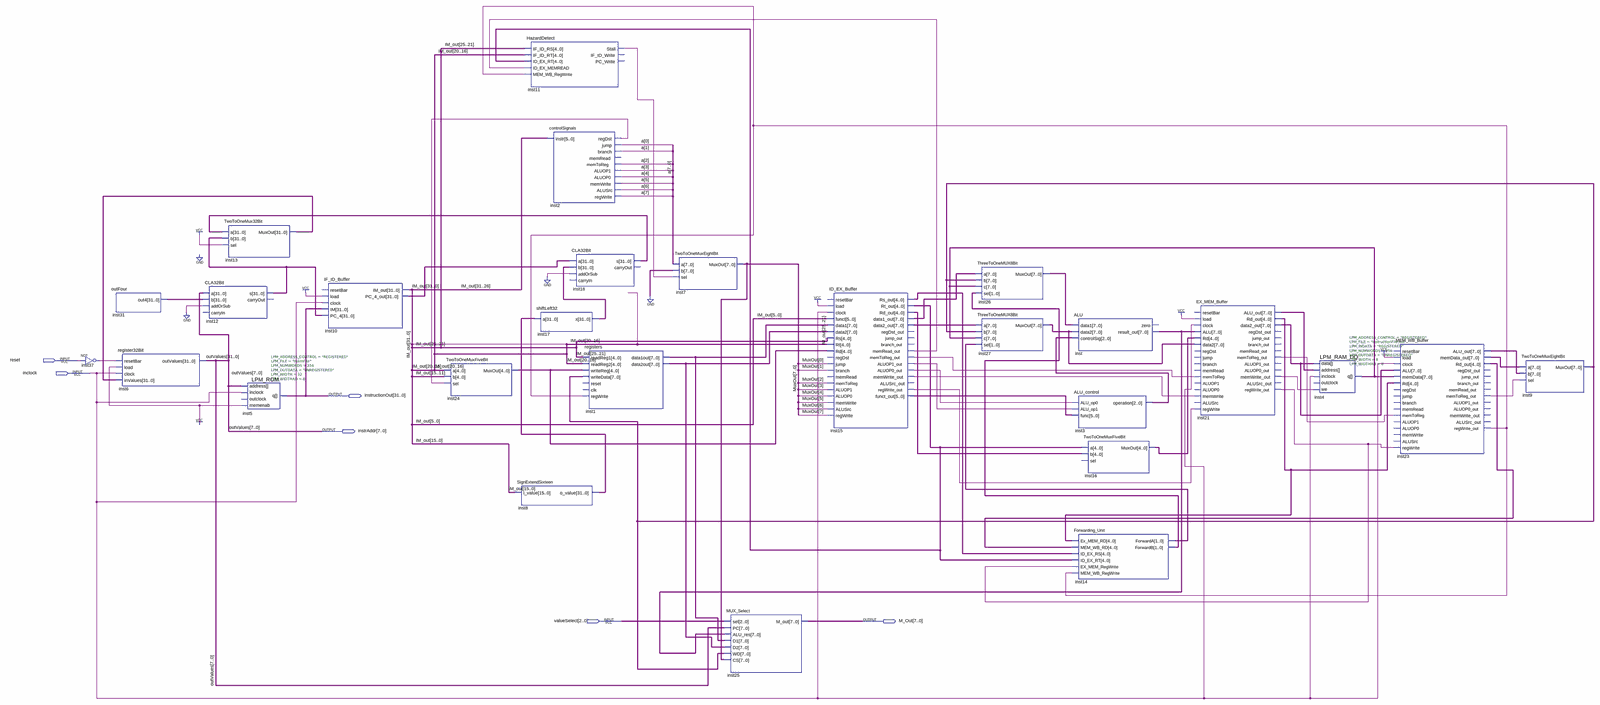
[diagram p0: schematic sheet, whole]
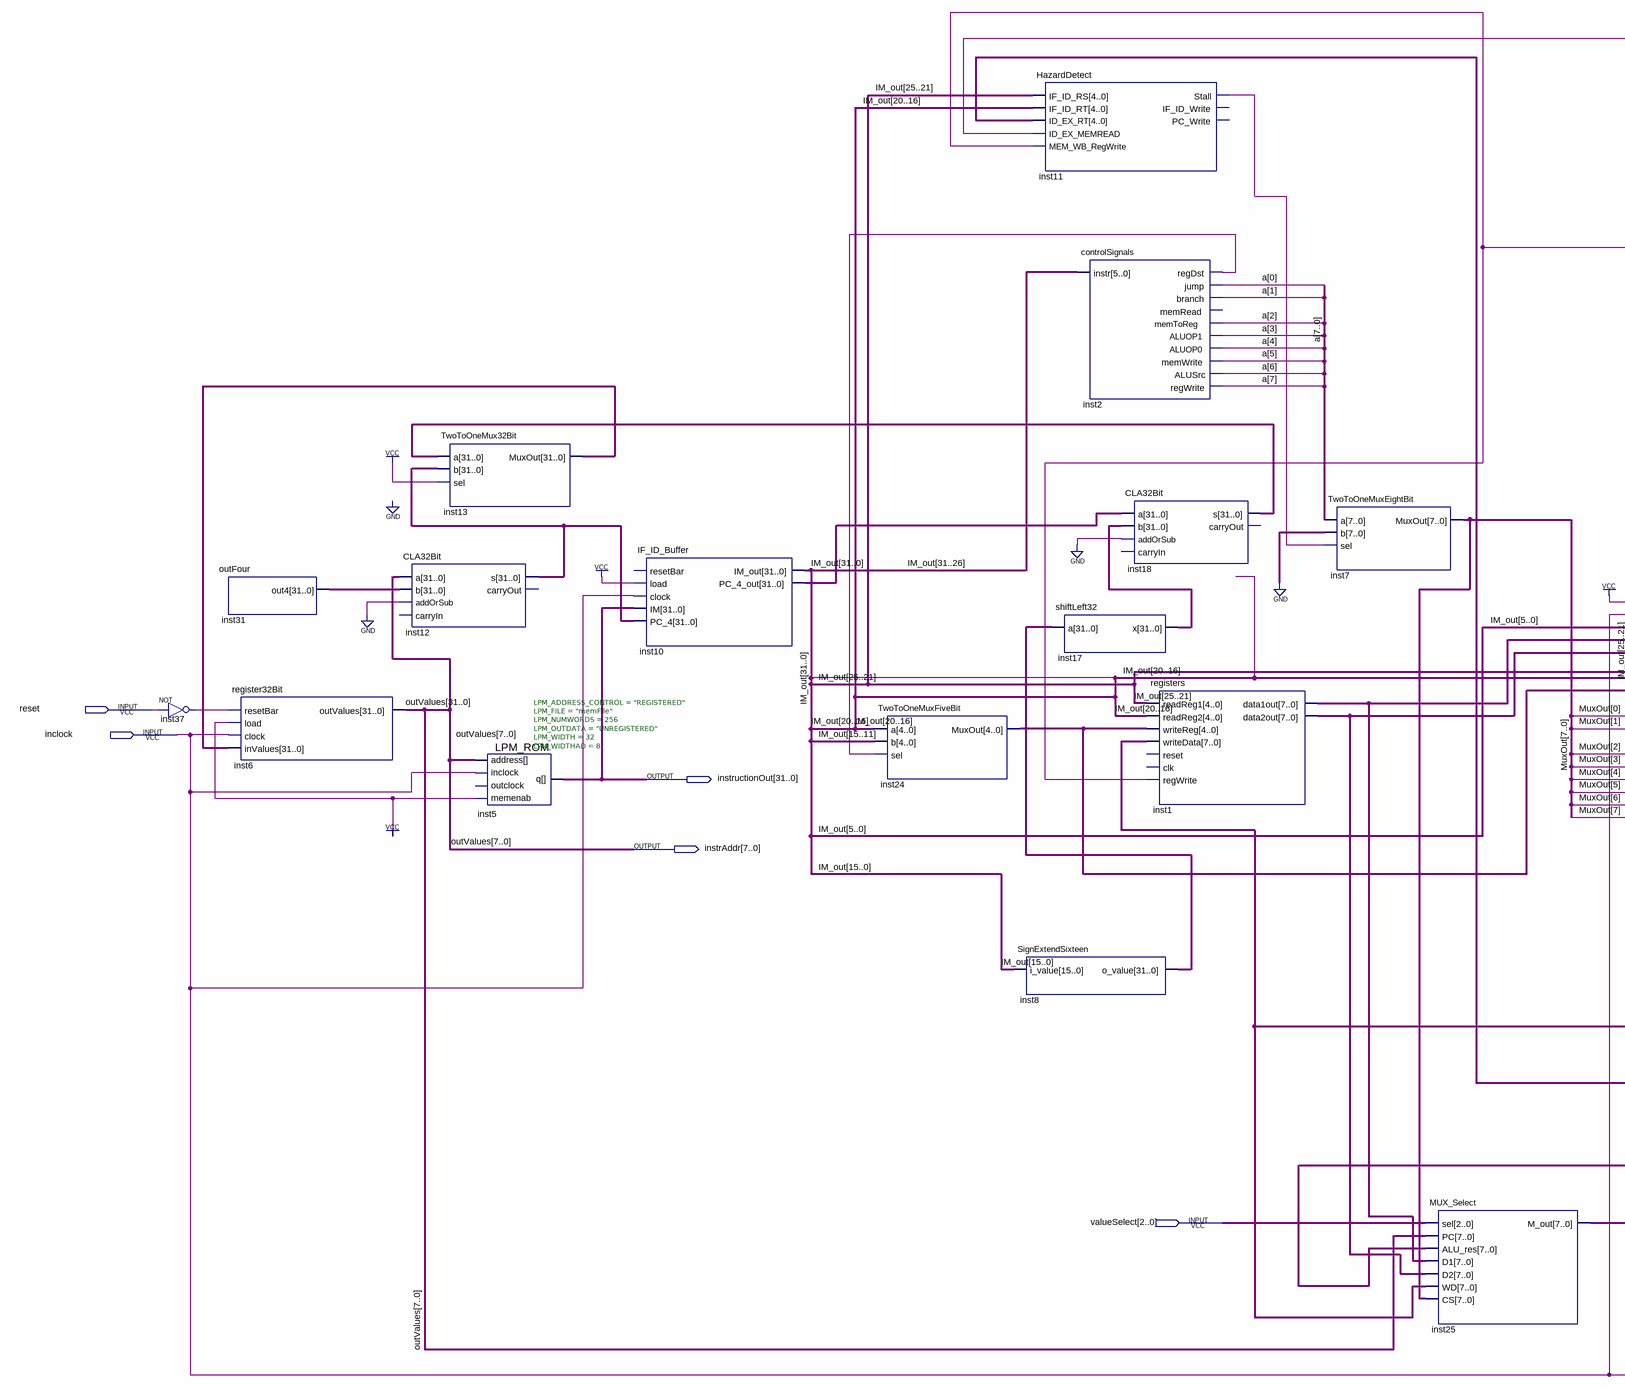
[diagram p1: schematic sheet, left part]
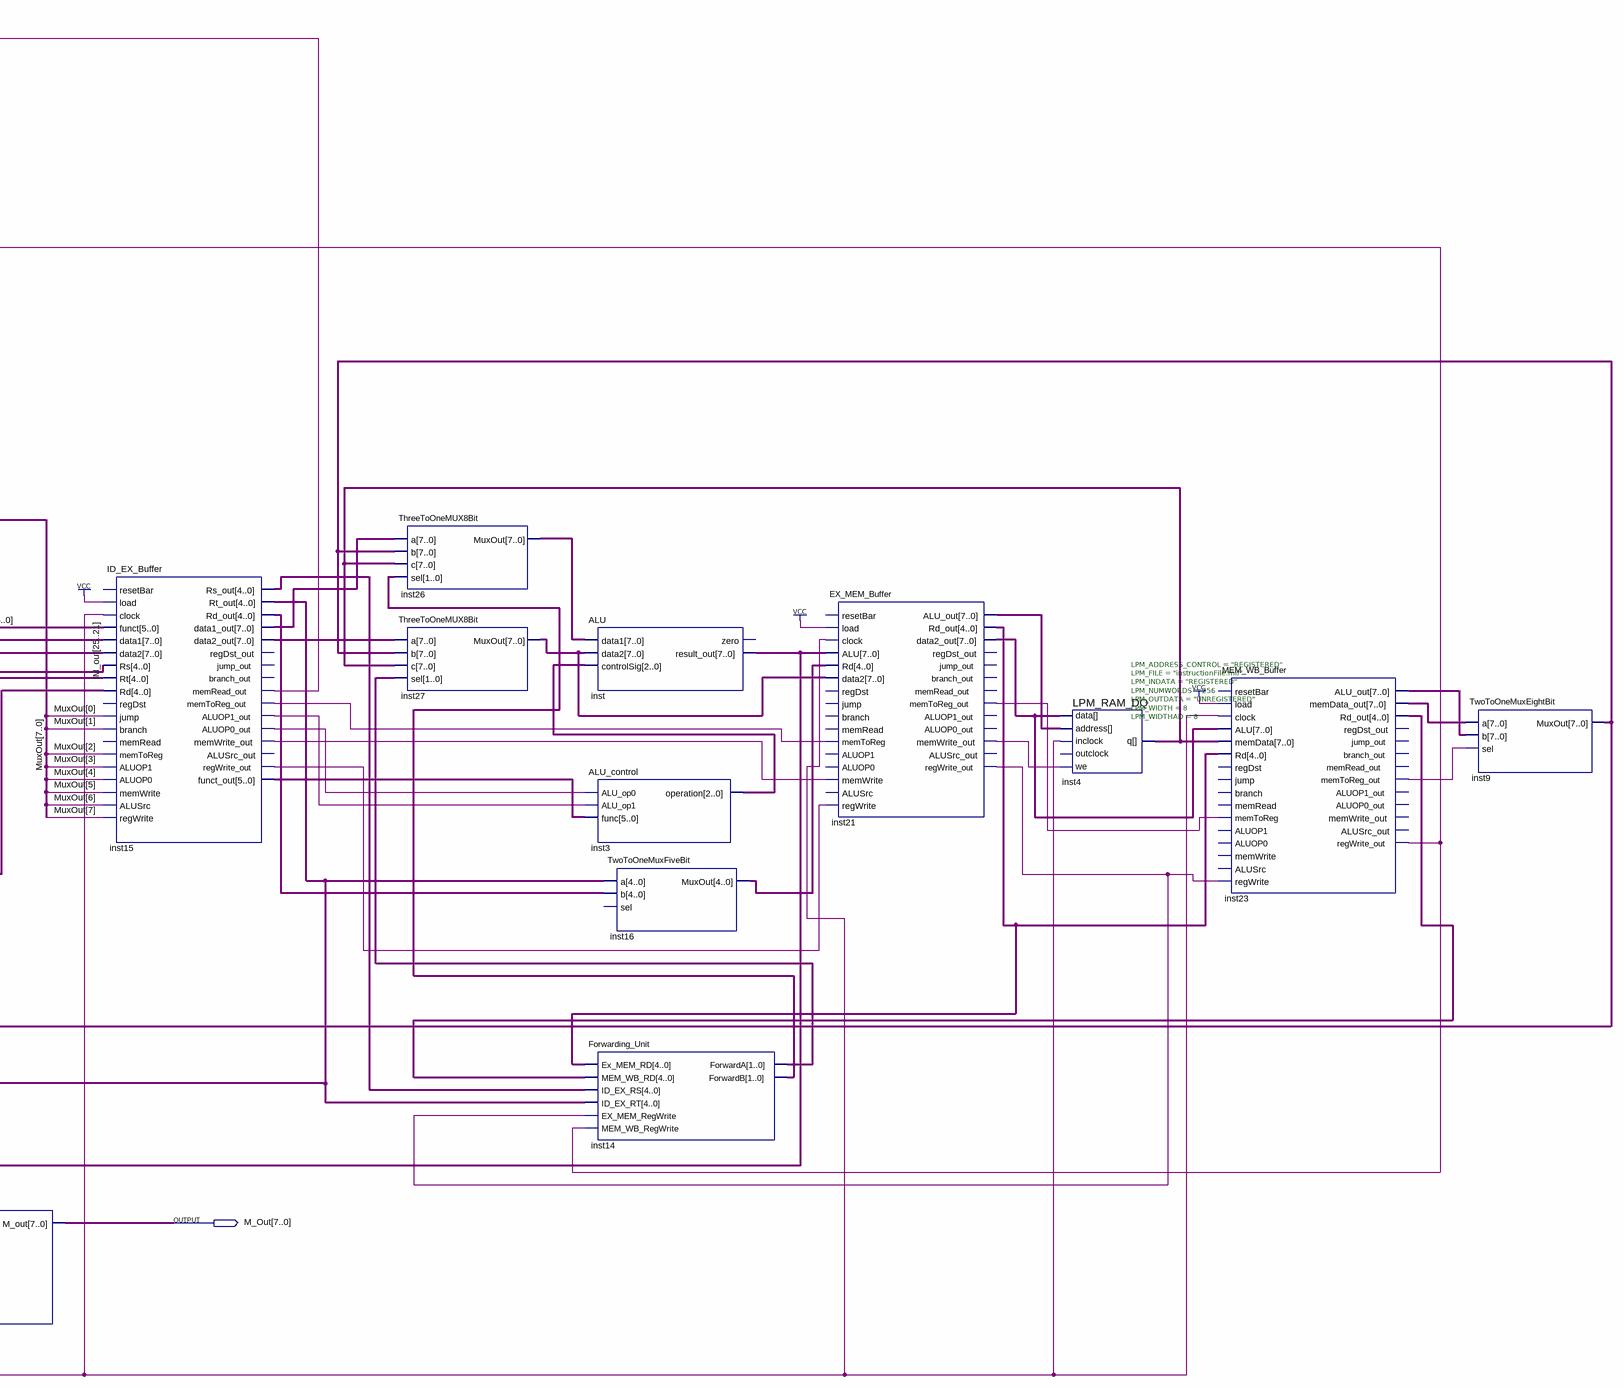
[diagram p2: schematic sheet, right part]
// Quartus schematic PipelinedProcessor.bdf as structural Verilog: 27 symbols, 6 pins
module PipelinedProcessor (
  input  reset,
  input  inclock,
  input  [2:0] valueSelect,
  output [31:0] instructionOut,
  output [7:0] instrAddr,
  output [7:0] M_Out
);

  wire inst2_regdst, inst11_stall, inst15_aluop0_out, inst15_aluop1_out, inst15_memread_out,
       inst15_memtoreg_out, inst15_memwrite_out, inst15_regwrite_out, inst21_memtoreg_out,
       inst21_memwrite_out, inst21_regwrite_out, inst23_memtoreg_out, inst23_regwrite_out, inst37_out;
  wire [1:0] inst14_forwarda, inst14_forwardb;
  wire [2:0] inst3_operation;
  wire [4:0] inst15_rd_out, inst15_rs_out, inst15_rt_out, inst16_muxout, inst21_rd_out, inst23_rd_out,
       inst24_muxout;
  wire [5:0] inst15_funct_out;
  wire [7:0] a, inst1_data1out, inst1_data2out, inst4_q, inst9_muxout, inst15_data1_out, inst15_data2_out,
       inst21_alu_out, inst21_data2_out, inst23_alu_out, inst23_memdata_out, inst26_muxout, inst27_muxout,
       inst_result_out, MuxOut;
  wire [31:0] IM_out, inst8_o_value, inst10_pc_4_out, inst12_s, inst13_muxout, inst17_x, inst18_s,
       inst31_out4;
  wire [31:8] outValues;

  not inst37 (inst37_out, reset);
  outFour inst31 (.out4(inst31_out4));
  register32Bit inst6 (
    .resetBar(inst37_out), .load(1'b1), .clock(inclock), .inValues(inst13_muxout),
    .outValues({outValues, instrAddr}));
  CLA32Bit inst12 (
    .a({outValues, instrAddr}), .b(inst31_out4), .addOrSub(1'b0), .s(inst12_s));  // open: carryIn, carryOut
  TwoToOneMux32Bit inst13 (.a(inst18_s), .b(inst12_s), .sel(1'b1), .MuxOut(inst13_muxout));
  LPM_ROM #(.LPM_ADDRESS_CONTROL("REGISTERED"), .LPM_FILE("memFile"), .LPM_NUMWORDS(256), .LPM_OUTDATA("UNREGISTERED"), .LPM_WIDTH(32), .LPM_WIDTHAD(8)) inst5 (
    .address(instrAddr), .inclock(inclock), .memenab(1'b1), .q(instructionOut));  // open: outclock
  IF_ID_Buffer inst10 (
    .load(1'b1), .clock(inclock), .IM(instructionOut), .PC_4(inst12_s), .IM_out(IM_out),
    .PC_4_out(inst10_pc_4_out));  // open: resetBar
  TwoToOneMuxFiveBit inst24 (.a(IM_out[20:16]), .b(IM_out[15:11]), .sel(inst2_regdst), .MuxOut(inst24_muxout));
  HazardDetect inst11 (
    .IF_ID_RS(IM_out[25:21]), .IF_ID_RT(IM_out[20:16]), .ID_EX_RT(inst15_rt_out),
    .ID_EX_MEMREAD(inst15_memread_out), .MEM_WB_RegWrite(inst23_regwrite_out), .Stall(inst11_stall));  // open: IF_ID_Write, PC_Write
  SignExtendSixteen inst8 (.i_value(IM_out[15:0]), .o_value(inst8_o_value));
  controlSignals inst2 (
    .instr(IM_out[31:26]), .regDst(inst2_regdst), .jump(a[0]), .branch(a[1]), .memToReg(a[2]), .ALUOP1(a[3]),
    .ALUOP0(a[4]), .memWrite(a[5]), .ALUSrc(a[6]), .regWrite(a[7]));  // open: memRead
  shiftLeft32 inst17 (.a(inst8_o_value), .x(inst17_x));
  CLA32Bit inst18 (.a(inst10_pc_4_out), .b(inst17_x), .addOrSub(1'b0), .s(inst18_s));  // open: carryIn, carryOut
  registers inst1 (
    .readReg1(IM_out[25:21]), .readReg2(IM_out[20:16]), .writeReg(inst24_muxout), .writeData(inst9_muxout),
    .regWrite(inst23_regwrite_out), .data1out(inst1_data1out), .data2out(inst1_data2out));  // open: reset, clk
  TwoToOneMuxEightBit inst7 (.a(a), .b({8{1'b0}}), .sel(inst11_stall), .MuxOut(MuxOut));
  MUX_Select inst25 (
    .sel(valueSelect), .PC(instrAddr), .ALU_res(inst_result_out), .D1(inst1_data1out), .D2(inst1_data2out),
    .WD(inst9_muxout), .CS(MuxOut), .M_out(M_Out));
  ID_EX_Buffer inst15 (
    .load(1'b1), .clock(inclock), .funct(IM_out[5:0]), .data1(inst1_data1out), .data2(inst1_data2out),
    .Rs(IM_out[25:21]), .Rt(IM_out[20:16]), .Rd(inst24_muxout), .jump(MuxOut[0]), .branch(MuxOut[1]),
    .memToReg(MuxOut[2]), .ALUOP1(MuxOut[3]), .ALUOP0(MuxOut[4]), .memWrite(MuxOut[5]), .ALUSrc(MuxOut[6]),
    .regWrite(MuxOut[7]), .Rs_out(inst15_rs_out), .Rt_out(inst15_rt_out), .Rd_out(inst15_rd_out),
    .data1_out(inst15_data1_out), .data2_out(inst15_data2_out), .memRead_out(inst15_memread_out),
    .memToReg_out(inst15_memtoreg_out), .ALUOP1_out(inst15_aluop1_out), .ALUOP0_out(inst15_aluop0_out),
    .memWrite_out(inst15_memwrite_out), .regWrite_out(inst15_regwrite_out), .funct_out(inst15_funct_out));  // open: resetBar, regDst, memRead, regDst_out, jump_out, branch_out, ALUSrc_out
  ThreeToOneMUX8Bit inst26 (
    .a(inst15_data1_out), .b(inst9_muxout), .c(inst4_q), .sel(inst14_forwardb), .MuxOut(inst26_muxout));
  ThreeToOneMUX8Bit inst27 (
    .a(inst15_data2_out), .b(inst9_muxout), .c(inst4_q), .sel(inst14_forwarda), .MuxOut(inst27_muxout));
  ALU inst (
    .data1(inst26_muxout), .data2(inst27_muxout), .controlSig(inst3_operation), .result_out(inst_result_out));  // open: zero
  ALU_control inst3 (
    .ALU_op0(inst15_aluop0_out), .ALU_op1(inst15_aluop1_out), .func(inst15_funct_out),
    .operation(inst3_operation));
  TwoToOneMuxFiveBit inst16 (.a(inst15_rt_out), .b(inst15_rd_out), .MuxOut(inst16_muxout));  // open: sel
  Forwarding_Unit inst14 (
    .Ex_MEM_RD(inst21_rd_out), .MEM_WB_RD(inst23_rd_out), .ID_EX_RS(inst15_rs_out), .ID_EX_RT(inst15_rt_out),
    .EX_MEM_RegWrite(inst21_regwrite_out), .MEM_WB_RegWrite(inst23_regwrite_out), .ForwardA(inst14_forwarda),
    .ForwardB(inst14_forwardb));
  EX_MEM_Buffer inst21 (
    .load(1'b1), .clock(inclock), .ALU(inst_result_out), .Rd(inst16_muxout), .data2(inst27_muxout),
    .memToReg(inst15_memtoreg_out), .memWrite(inst15_memwrite_out), .regWrite(inst15_regwrite_out),
    .ALU_out(inst21_alu_out), .Rd_out(inst21_rd_out), .data2_out(inst21_data2_out),
    .memToReg_out(inst21_memtoreg_out), .memWrite_out(inst21_memwrite_out), .regWrite_out(inst21_regwrite_out));  // open: resetBar, regDst, jump, branch, memRead, ALUOP1, ALUOP0, ALUSrc, regDst_out, jump_out, branch_out, memRead_out, ALUOP1_out, ALUOP0_out, ALUSrc_out
  LPM_RAM_DQ #(.LPM_ADDRESS_CONTROL("REGISTERED"), .LPM_FILE("instructionFile.mif"), .LPM_INDATA("REGISTERED"), .LPM_NUMWORDS(256), .LPM_OUTDATA("UNREGISTERED"), .LPM_WIDTH(8), .LPM_WIDTHAD(8)) inst4 (
    .inclock(inclock), .data(inst21_data2_out), .address(inst21_alu_out), .we(inst21_memwrite_out),
    .q(inst4_q));  // open: outclock
  MEM_WB_Buffer inst23 (
    .load(1'b1), .clock(inclock), .ALU(inst21_data2_out), .memData(inst4_q), .Rd(inst21_rd_out),
    .memToReg(inst21_memtoreg_out), .regWrite(inst21_regwrite_out), .ALU_out(inst23_alu_out),
    .memData_out(inst23_memdata_out), .Rd_out(inst23_rd_out), .memToReg_out(inst23_memtoreg_out),
    .regWrite_out(inst23_regwrite_out));  // open: resetBar, regDst, jump, branch, memRead, ALUOP1, ALUOP0, memWrite, ALUSrc, regDst_out, jump_out, branch_out, memRead_out, ALUOP1_out, ALUOP0_out, memWrite_out, ALUSrc_out
  TwoToOneMuxEightBit inst9 (
    .a(inst23_memdata_out), .b(inst23_alu_out), .sel(inst23_memtoreg_out), .MuxOut(inst9_muxout));

  // Other names for the same wires on the sheet: outValues[7:0] = instrAddr
endmodule
